# Altium schematic sheet Encoder AFE incremental.SchDoc
size A4
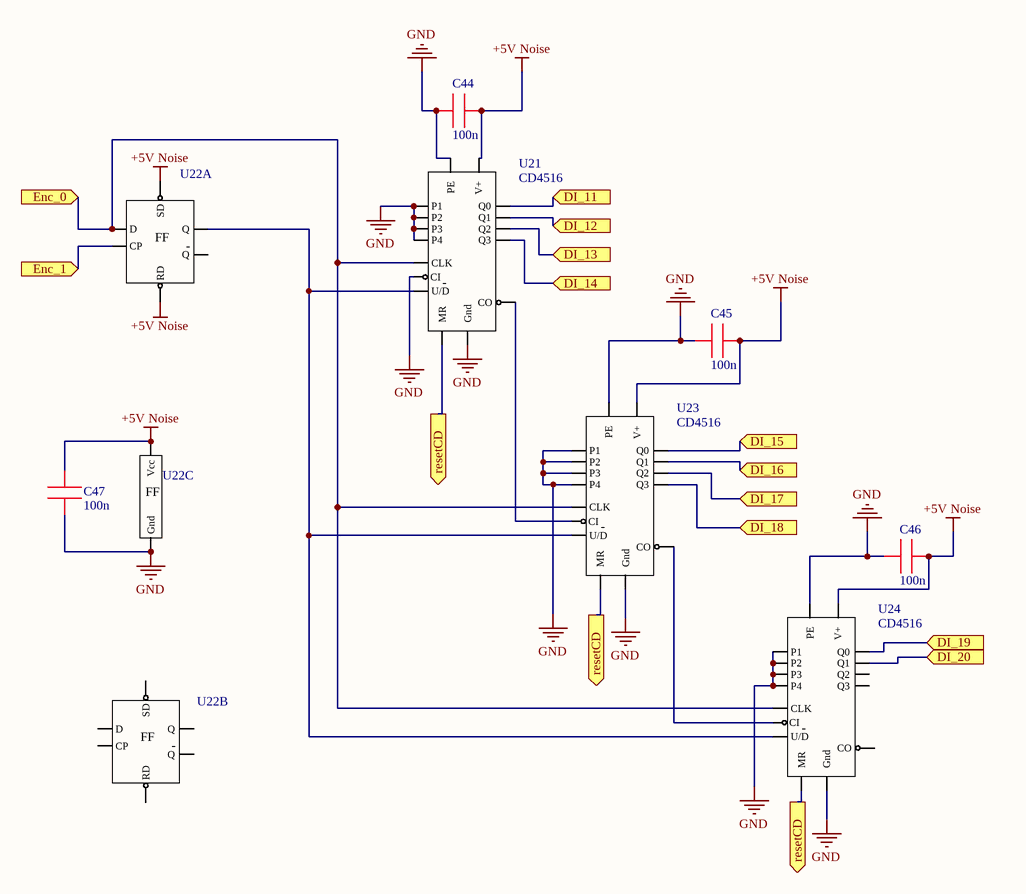
[diagram p0: Encoder AFE incremental.SchDoc]

## Parts
C44  100n  [0603]
C45  100n  [0603]
C46  100n  [0603]
C47  100n  [0603]
U21  CD4516  [TSSOP-16]
U22  74HC74D  [SOIC 14 lead]  (value not drawn)  (parts A,B,C of 3)
U23  CD4516  [TSSOP-16]
U24  CD4516  [TSSOP-16]

## Ports
DI_11, DI_12, DI_13, DI_14, DI_15, DI_16, DI_17, DI_18, DI_19, DI_20, Enc_0, Enc_1, resetCD

## Nets
+5V Noise: C44.2 C45.2 C46.2 C47.2 U21.16(V+) U22.1(RD) U22.4(SD) U22.14(Vcc) U23.16(V+) U24.16(V+)
GND: C44.1 C45.1 C46.1 C47.1 U21.1(PE) U21.3(P4) U21.4(P1) U21.5(CI) U21.8(Gnd) U21.12(P2) U21.13(P3) U22.7(Gnd) U23.1(PE) U23.3(P4) U23.4(P1) U23.8(Gnd) U23.12(P2) U23.13(P3) U24.1(PE) U24.3(P4) U24.4(P1) U24.8(Gnd) U24.12(P2) U24.13(P3)
DI_11: U21.6(Q0) ; port DI_11
DI_12: U21.11(Q1) ; port DI_12
DI_13: U21.14(Q2) ; port DI_13
DI_14: U21.2(Q3) ; port DI_14
DI_15: U23.6(Q0) ; port DI_15
DI_16: U23.11(Q1) ; port DI_16
DI_17: U23.14(Q2) ; port DI_17
DI_18: U23.2(Q3) ; port DI_18
DI_19: U24.6(Q0) ; port DI_19
DI_20: U24.11(Q1) ; port DI_20
Enc_0: U21.15(CLK) U22.2(D) U23.15(CLK) U24.15(CLK) ; port Enc_0
Enc_1: U22.3(CP) ; port Enc_1
resetCD: U21.9(MR) U23.9(MR) U24.9(MR) ; port resetCD
NetU21_7: U21.7(CO) U23.5(CI)
NetU21_10: U21.10(U/D) U22.5(Q) U23.10(U/D) U24.10(U/D)
NetU23_7: U23.7(CO) U24.5(CI)

Not connected (* = marked no-connect by the designer): U22 6(Q) 8(Q) 9(Q) 10(SD) 11(CP) 12(D) 13(RD); U24 2(Q3) 7(CO) 14(Q2)

## Notes on the sheet
- (in symbol 74HC74D, part A) FF; -
- (in symbol 74HC74D, part B) FF; -
- (in symbol 74HC74D, part C) FF
- (in symbol CD4516) -

## Library data of the parts
C44-C47 = 0603 CAP: CC0603KRX7R9BB104
U22 = 74HC74D: 74HC74D,653